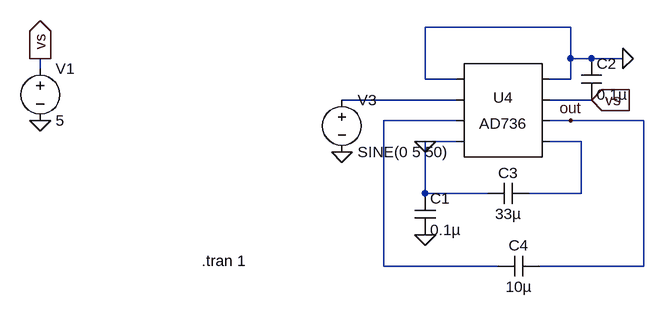
[diagram p0: schematic AD737_test.asc]
AD737_test.asc, the LTspice schematic file:
Version 4
SHEET 1 980 680
WIRE 384 48 160 48
WIRE 384 96 384 48
WIRE 416 96 384 96
WIRE 464 96 416 96
WIRE -432 112 -432 96
WIRE 160 128 160 48
WIRE 208 128 160 128
WIRE 384 128 384 96
WIRE 384 128 352 128
WIRE 208 160 32 160
WIRE 416 160 352 160
WIRE 208 192 96 192
WIRE 384 192 352 192
WIRE 496 192 384 192
WIRE 208 224 160 224
WIRE 400 224 352 224
WIRE 160 304 160 224
WIRE 256 304 160 304
WIRE 400 304 400 224
WIRE 400 304 320 304
WIRE 96 416 96 192
WIRE 272 416 96 416
WIRE 496 416 496 192
WIRE 496 416 336 416
FLAG 32 240 0
FLAG 384 192 out
FLAG 464 96 0
FLAG 160 368 0
FLAG -432 96 vs
IOPIN -432 96 Out
FLAG 416 160 vs
IOPIN 416 160 In
FLAG 160 224 0
FLAG -432 192 0
SYMBOL voltage -432 96 R0
WINDOW 123 0 0 Left 0
WINDOW 39 0 0 Left 0
SYMATTR InstName V1
SYMATTR Value 5
SYMBOL voltage 32 144 R0
WINDOW 123 0 0 Left 0
WINDOW 39 0 0 Left 0
SYMATTR InstName V3
SYMATTR Value SINE(0 5 50)
SYMBOL cap 320 288 R90
WINDOW 0 0 32 VBottom 2
WINDOW 3 32 32 VTop 2
SYMATTR InstName C3
SYMATTR Value 33µ
SYMBOL AutoGenerated\\AD736 272 176 R0
SYMATTR InstName U4
SYMBOL cap 144 304 R0
SYMATTR InstName C1
SYMATTR Value 0.1µ
SYMBOL cap 400 96 R0
SYMATTR InstName C2
SYMATTR Value 0.1µ
SYMBOL cap 336 400 R90
WINDOW 0 0 32 VBottom 2
WINDOW 3 32 32 VTop 2
SYMATTR InstName C4
SYMATTR Value 10µ
TEXT -184 408 Left 2 !.tran 1

The netlist it stands for:
* AD737_test.asc
V1 vs 0 5
V3 N001 0 SINE(0 5 50)
C3 N003 0 33µ
* U4: AD736 (symbol AutoGenerated\AD736 not available, pins judged from their places): pin1=0 pin2=N001 pin3=N002 pin4=0 pin5=0 pin6=vs pin7=out pin8=N003
C1 0 0 0.1µ
C2 0 vs 0.1µ
C4 out N002 10µ
.tran 1
.backanno
.end